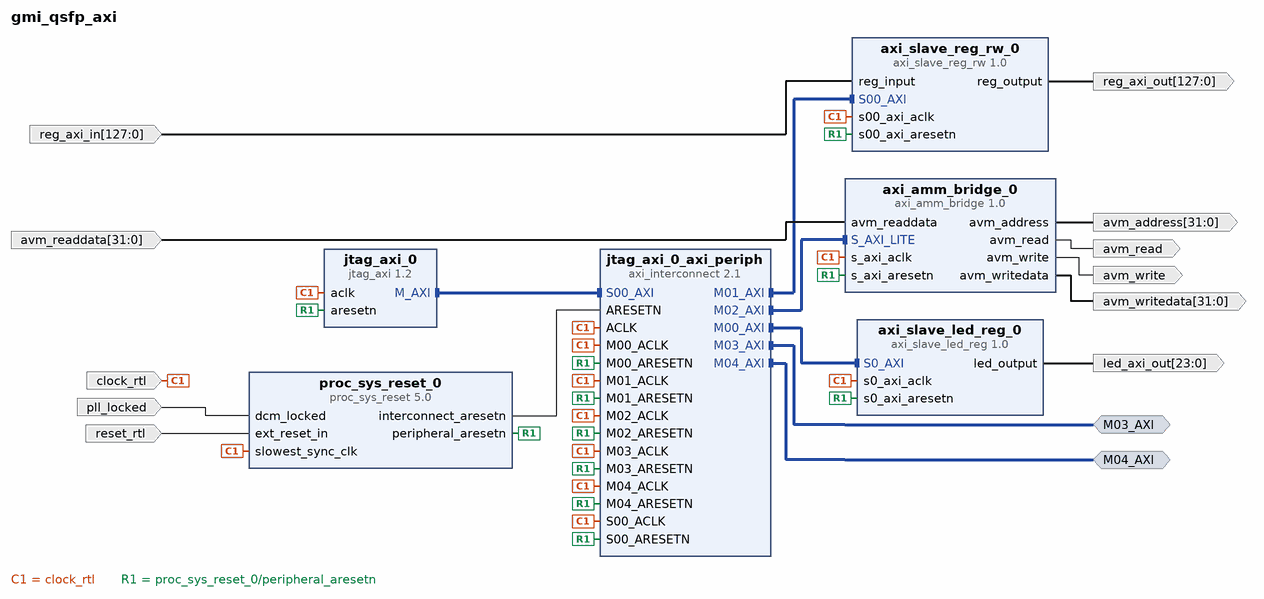
[diagram p0: block diagram of the top level]
# Vivado block design gmi_qsfp_axi, xcvu9p-flga2577-2L-e-es1, Vivado 2016.4
create_bd_design gmi_qsfp_axi

create_bd_intf_port -mode Master -vlnv xilinx.com:interface:aximm_rtl:1.0 M03_AXI
set_property -dict [list \
  CONFIG.DATA_WIDTH 32 \
  CONFIG.PROTOCOL AXI4LITE \
  CONFIG.FREQ_HZ 125000000 \
  CONFIG.ADDR_WIDTH 32 \
  CONFIG.HAS_BURST 0 \
  CONFIG.HAS_LOCK 0 \
  CONFIG.HAS_CACHE 0 \
  CONFIG.HAS_QOS 0 \
  CONFIG.HAS_REGION 0 \
] [get_bd_intf_ports M03_AXI]
create_bd_intf_port -mode Master -vlnv xilinx.com:interface:aximm_rtl:1.0 M04_AXI
set_property -dict [list \
  CONFIG.DATA_WIDTH 32 \
  CONFIG.PROTOCOL AXI4LITE \
  CONFIG.FREQ_HZ 125000000 \
  CONFIG.ADDR_WIDTH 32 \
  CONFIG.HAS_BURST 0 \
  CONFIG.HAS_LOCK 0 \
  CONFIG.HAS_CACHE 0 \
  CONFIG.HAS_QOS 0 \
  CONFIG.HAS_REGION 0 \
] [get_bd_intf_ports M04_AXI]
create_bd_port -dir I pll_locked
create_bd_port -dir O -from 23 -to 0 led_axi_out
create_bd_port -dir O -from 127 -to 0 reg_axi_out
create_bd_port -dir I -from 127 -to 0 reg_axi_in
create_bd_port -dir O -from 31 -to 0 avm_address
create_bd_port -dir O avm_read
create_bd_port -dir O avm_write
create_bd_port -dir O -from 31 -to 0 avm_writedata
create_bd_port -dir I -from 31 -to 0 avm_readdata
create_bd_port -dir I -type clk clock_rtl
set_property -dict {CONFIG.FREQ_HZ 125000000} [get_bd_ports clock_rtl]
create_bd_port -dir I -type rst reset_rtl
set_property -dict {CONFIG.POLARITY ACTIVE_HIGH} [get_bd_ports reset_rtl]

create_bd_cell -type ip -vlnv xilinx.com:ip:proc_sys_reset:5.0 proc_sys_reset_0
set_property -dict {CONFIG.C_AUX_RESET_HIGH 0} [get_bd_cells proc_sys_reset_0]
create_bd_cell -type ip -vlnv xilinx.com:ip:jtag_axi:1.2 jtag_axi_0
create_bd_cell -type ip -vlnv user.org:user:axi_slave_led_reg:1.0 axi_slave_led_reg_0
create_bd_cell -type ip -vlnv user.org:user:axi_slave_reg_rw:1.0 axi_slave_reg_rw_0
create_bd_cell -type ip -vlnv xilinx.com:ip:axi_amm_bridge:1.0 axi_amm_bridge_0
set_property -dict [list \
  CONFIG.C_HAS_WAIT_REQUEST 0 \
  CONFIG.C_HAS_READ_DATA_VALID 0 \
  CONFIG.C_USE_BYTEENABLE 0 \
  CONFIG.C_HAS_RESPONSE 0 \
] [get_bd_cells axi_amm_bridge_0]
create_bd_cell -type ip -vlnv xilinx.com:ip:axi_interconnect:2.1 jtag_axi_0_axi_periph
set_property -dict {CONFIG.NUM_MI 5 CONFIG.ENABLE_ADVANCED_OPTIONS 0} [get_bd_cells jtag_axi_0_axi_periph]

# ---- connections ----

connect_bd_intf_net [get_bd_intf_pins jtag_axi_0/M_AXI] [get_bd_intf_pins jtag_axi_0_axi_periph/S00_AXI]
connect_bd_intf_net [get_bd_intf_pins jtag_axi_0_axi_periph/M00_AXI] [get_bd_intf_pins axi_slave_led_reg_0/S0_AXI]
connect_bd_intf_net [get_bd_intf_pins jtag_axi_0_axi_periph/M01_AXI] [get_bd_intf_pins axi_slave_reg_rw_0/S00_AXI]
connect_bd_intf_net [get_bd_intf_pins jtag_axi_0_axi_periph/M02_AXI] [get_bd_intf_pins axi_amm_bridge_0/S_AXI_LITE]
connect_bd_intf_net [get_bd_intf_ports M03_AXI] [get_bd_intf_pins jtag_axi_0_axi_periph/M03_AXI]
connect_bd_intf_net [get_bd_intf_ports M04_AXI] [get_bd_intf_pins jtag_axi_0_axi_periph/M04_AXI]
connect_bd_net -net clk_wiz_clk_out1 [get_bd_ports clock_rtl] \
  [get_bd_pins jtag_axi_0/aclk] [get_bd_pins proc_sys_reset_0/slowest_sync_clk] [get_bd_pins axi_slave_led_reg_0/s0_axi_aclk] \
  [get_bd_pins axi_slave_reg_rw_0/s00_axi_aclk] [get_bd_pins axi_amm_bridge_0/s_axi_aclk] \
  [get_bd_pins jtag_axi_0_axi_periph/S00_ACLK] [get_bd_pins jtag_axi_0_axi_periph/ACLK] \
  [get_bd_pins jtag_axi_0_axi_periph/M00_ACLK] [get_bd_pins jtag_axi_0_axi_periph/M01_ACLK] \
  [get_bd_pins jtag_axi_0_axi_periph/M02_ACLK] [get_bd_pins jtag_axi_0_axi_periph/M03_ACLK] \
  [get_bd_pins jtag_axi_0_axi_periph/M04_ACLK]
connect_bd_net [get_bd_pins proc_sys_reset_0/peripheral_aresetn] \
  [get_bd_pins jtag_axi_0/aresetn] [get_bd_pins axi_slave_led_reg_0/s0_axi_aresetn] \
  [get_bd_pins axi_slave_reg_rw_0/s00_axi_aresetn] [get_bd_pins jtag_axi_0_axi_periph/S00_ARESETN] \
  [get_bd_pins jtag_axi_0_axi_periph/M00_ARESETN] [get_bd_pins jtag_axi_0_axi_periph/M01_ARESETN] \
  [get_bd_pins axi_amm_bridge_0/s_axi_aresetn] [get_bd_pins jtag_axi_0_axi_periph/M02_ARESETN] \
  [get_bd_pins jtag_axi_0_axi_periph/M03_ARESETN] [get_bd_pins jtag_axi_0_axi_periph/M04_ARESETN]
connect_bd_net [get_bd_ports pll_locked] [get_bd_pins proc_sys_reset_0/dcm_locked]
connect_bd_net [get_bd_pins axi_slave_led_reg_0/led_output] [get_bd_ports led_axi_out]
connect_bd_net [get_bd_pins axi_slave_reg_rw_0/reg_output] [get_bd_ports reg_axi_out]
connect_bd_net [get_bd_ports reg_axi_in] [get_bd_pins axi_slave_reg_rw_0/reg_input]
connect_bd_net [get_bd_pins axi_amm_bridge_0/avm_address] [get_bd_ports avm_address]
connect_bd_net [get_bd_pins axi_amm_bridge_0/avm_read] [get_bd_ports avm_read]
connect_bd_net [get_bd_pins axi_amm_bridge_0/avm_write] [get_bd_ports avm_write]
connect_bd_net [get_bd_pins axi_amm_bridge_0/avm_writedata] [get_bd_ports avm_writedata]
connect_bd_net [get_bd_ports avm_readdata] [get_bd_pins axi_amm_bridge_0/avm_readdata]
connect_bd_net [get_bd_ports reset_rtl] [get_bd_pins proc_sys_reset_0/ext_reset_in]
connect_bd_net [get_bd_pins proc_sys_reset_0/interconnect_aresetn] [get_bd_pins jtag_axi_0_axi_periph/ARESETN]

# ---- address map ----
assign_bd_address -offset 0x44A00000 -range 64K -target_address_space [get_bd_addr_spaces jtag_axi_0/Data] [get_bd_addr_segs axi_slave_led_reg_0/S0_AXI/S0_AXI_reg]
assign_bd_address -offset 0x44A10000 -range 64K -target_address_space [get_bd_addr_spaces jtag_axi_0/Data] [get_bd_addr_segs axi_slave_reg_rw_0/S00_AXI/S00_AXI_reg]
assign_bd_address -offset 0x44A20000 -range 64K -target_address_space [get_bd_addr_spaces jtag_axi_0/Data] [get_bd_addr_segs axi_amm_bridge_0/S_AXI_LITE/Reg]
assign_bd_address -offset 0x44A30000 -range 64K -target_address_space [get_bd_addr_spaces jtag_axi_0/Data] [get_bd_addr_segs M04_AXI/Reg]
assign_bd_address -offset 0x44A40000 -range 64K -target_address_space [get_bd_addr_spaces jtag_axi_0/Data] [get_bd_addr_segs M03_AXI/Reg]

validate_bd_design
save_bd_design
